# EAGLE schematic 1.4Fv3 (EAGLE 9.2.2)
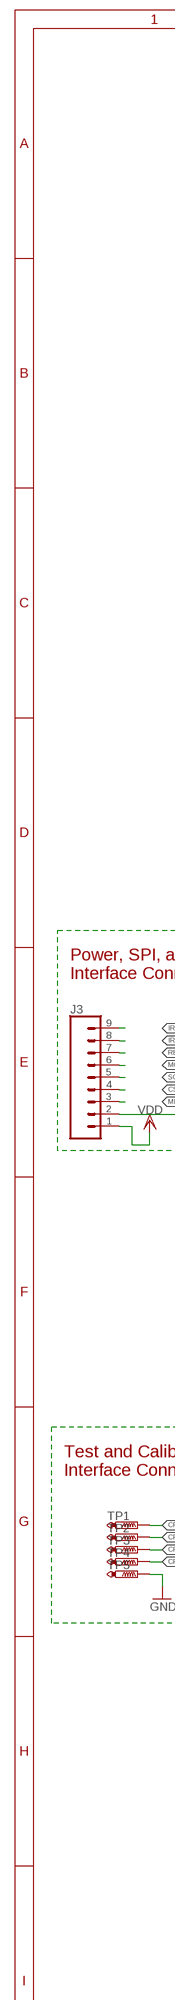
[diagram p0: schematic, sheet 1, part 1 of 3]
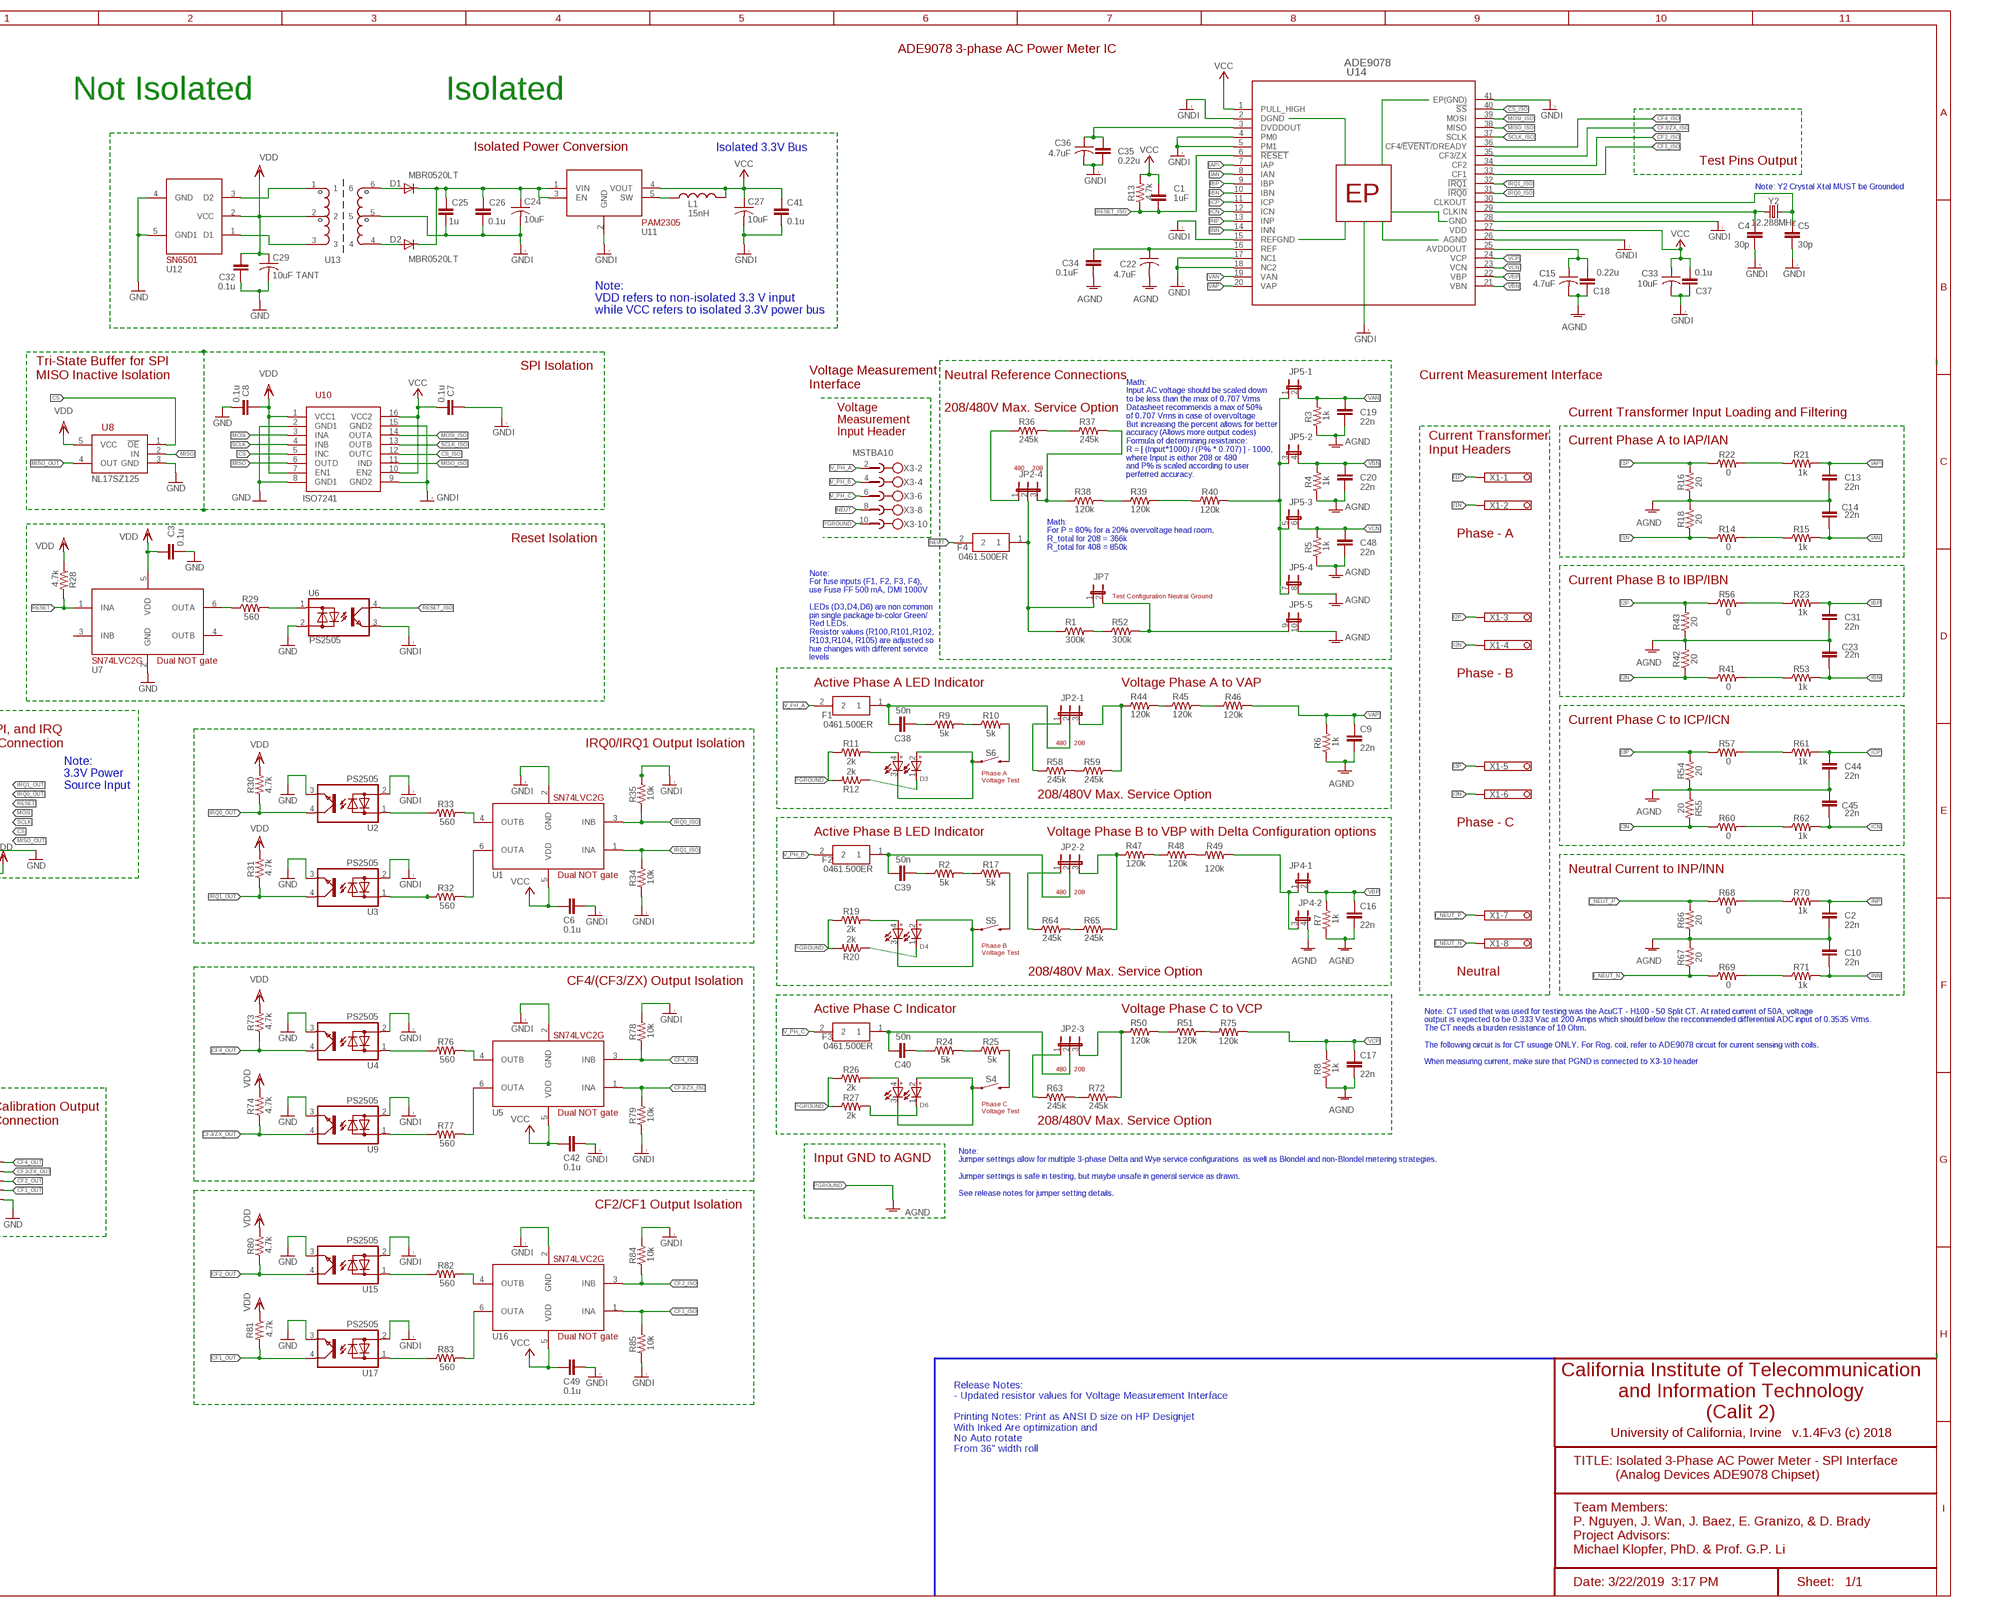
[diagram p1: schematic, sheet 1, part 2 of 3]
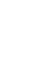
[diagram p2: schematic, sheet 1, part 3 of 3]

## Parts
C1  1uF  10NF-0603-50V-10%  [0603]
C2  22n  0402-CAP  [0402-CAP]
C3  0.1u  0402-CAP  [0402-CAP]
C4  30p  0402-CAP  [0402-CAP]
C5  30p  0402-CAP  [0402-CAP]
C6  0.1u  0402-CAP  [0402-CAP]
C7  0.1u  0402-CAP  [0402-CAP]
C8  0.1u  0402-CAP  [0402-CAP]
C9  22n  0402-CAP  [0402-CAP]
C10  22n  0402-CAP  [0402-CAP]
C13  22n  0402-CAP  [0402-CAP]
C14  22n  0402-CAP  [0402-CAP]
C15  4.7uF  C-USC0603  [C0603]
C16  22n  0402-CAP  [0402-CAP]
C17  22n  0402-CAP  [0402-CAP]
C18  0.22u  0402-CAP  [0402-CAP]
C19  22n  0402-CAP  [0402-CAP]
C20  22n  0402-CAP  [0402-CAP]
C22  4.7uF  C-USC0603  [C0603]
C23  22n  0402-CAP  [0402-CAP]
C24  10uF  C-USC0603  [C0603]
C25  1u  0402-CAP  [0402-CAP]
C26  0.1u  0402-CAP  [0402-CAP]
C27  10uF  C-USC0603  [C0603]
C29  10uF TANT  C-USC0603  [C0603]
C31  22n  0402-CAP  [0402-CAP]
C32  0.1u  0402-CAP  [0402-CAP]
C33  10uF  C-USC0603  [C0603]
C34  0.1uF  0402-CAP  [0402-CAP]
C35  0.22u  0402-CAP  [0402-CAP]
C36  4.7uF  C-USC0603  [C0603]
C37  0.1u  0402-CAP  [0402-CAP]
C38  50n  0402-CAP  [0402-CAP]
C39  50n  0402-CAP  [0402-CAP]
C40  50n  0402-CAP  [0402-CAP]
C41  0.1u  0402-CAP  [0402-CAP]
C42  0.1u  0402-CAP  [0402-CAP]
C44  22n  0402-CAP  [0402-CAP]
C45  22n  0402-CAP  [0402-CAP]
C48  22n  0402-CAP  [0402-CAP]
C49  0.1u  0402-CAP  [0402-CAP]
D1  MBR0520LT  [SOD123]
D2  MBR0520LT  [SOD123]
D3  WL-SBCW_0606_150066SV74000  [WL-SBCW_0606]
D4  WL-SBCW_0606_150066SV74000  [WL-SBCW_0606]
D6  WL-SBCW_0606_150066SV74000  [WL-SBCW_0606]
F1  0461.500ER  [FUSC10131X312N]
F2  0461.500ER  [FUSC10131X312N]
F3  0461.500ER  [FUSC10131X312N]
F4  0461.500ER  [FUSC10131X312N]
J3  CONN_09  [1X09]
JP2-1  JP2E  [JP2]
JP2-2  JP2E  [JP2]
JP2-3  JP2E  [JP2]
JP2-4  JP2E  [JP2]
JP4  JP2QE  [JP2Q]
JP5  JP5QE  [JP5Q]
JP7  JP1E  [JP1]
L1  15nH  IND0402  [0402-RES]
R1  300k  R_2010  [R2010]
R2  5k  RESISTOR0603  [0603]
R3  1k  RESISTOR0603  [0603]
R4  1k  RESISTOR0603  [0603]
R5  1k  RESISTOR0603  [0603]
R6  1k  RESISTOR0603  [0603]
R7  1k  RESISTOR0603  [0603]
R8  1k  RESISTOR0603  [0603]
R9  5k  RESISTOR0603  [0603]
R10  5k  RESISTOR0603  [0603]
R11  2k  RESISTOR0603  [0603]
R12  2k  RESISTOR0603  [0603]
R13  4.7k  RESISTOR0603  [0603]
R14  0  RESISTOR0603  [0603]
R15  1k  RESISTOR0603  [0603]
R16  20  RESISTOR0603  [0603]
R17  5k  RESISTOR0603  [0603]
R18  20  RESISTOR0603  [0603]
R19  2k  RESISTOR0603  [0603]
R20  2k  RESISTOR0603  [0603]
R21  1k  RESISTOR0603  [0603]
R22  0  RESISTOR0603  [0603]
R23  1k  RESISTOR0603  [0603]
R24  5k  RESISTOR0603  [0603]
R25  5k  RESISTOR0603  [0603]
R26  2k  RESISTOR0603  [0603]
R27  2k  RESISTOR0603  [0603]
R28  4.7k  RESISTOR0603  [0603]
R29  560  RESISTOR0603  [0603]
R30  4.7k  RESISTOR0603  [0603]
R31  4.7k  RESISTOR0603  [0603]
R32  560  RESISTOR0603  [0603]
R33  560  RESISTOR0603  [0603]
R34  10k  RESISTOR0603  [0603]
R35  10k  RESISTOR0603  [0603]
R36  245k  R_2010  [R2010]
R37  245k  R_2010  [R2010]
R38  120k  R_2010  [R2010]
R39  120k  R_2010  [R2010]
R40  120k  RESISTOR0603  [0603]
R41  0  RESISTOR0603  [0603]
R42  20  RESISTOR0603  [0603]
R43  20  RESISTOR0603  [0603]
R44  120k  R_2010  [R2010]
R45  120k  R_2010  [R2010]
R46  120k  RESISTOR0603  [0603]
R47  120k  R_2010  [R2010]
R48  120k  R_2010  [R2010]
R49  120k  RESISTOR0603  [0603]
R50  120k  R_2010  [R2010]
R51  120k  R_2010  [R2010]
R52  300k  R_2010  [R2010]
R53  1k  RESISTOR0603  [0603]
R54  20  RESISTOR0603  [0603]
R55  20  RESISTOR0603  [0603]
R56  0  RESISTOR0603  [0603]
R57  0  RESISTOR0603  [0603]
R58  245k  R_2010  [R2010]
R59  245k  R_2010  [R2010]
R60  0  RESISTOR0603  [0603]
R61  1k  RESISTOR0603  [0603]
R62  1k  RESISTOR0603  [0603]
R63  245k  R_2010  [R2010]
R64  245k  R_2010  [R2010]
R65  245k  R_2010  [R2010]
R66  20  RESISTOR0603  [0603]
R67  20  RESISTOR0603  [0603]
R68  0  RESISTOR0603  [0603]
R69  0  RESISTOR0603  [0603]
R70  1k  RESISTOR0603  [0603]
R71  1k  RESISTOR0603  [0603]
R72  245k  R_2010  [R2010]
R73  4.7k  RESISTOR0603  [0603]
R74  4.7k  RESISTOR0603  [0603]
R75  120k  RESISTOR0603  [0603]
R76  560  RESISTOR0603  [0603]
R77  560  RESISTOR0603  [0603]
R78  10k  RESISTOR0603  [0603]
R79  10k  RESISTOR0603  [0603]
R80  4.7k  RESISTOR0603  [0603]
R81  4.7k  RESISTOR0603  [0603]
R82  560  RESISTOR0603  [0603]
R83  560  RESISTOR0603  [0603]
R84  10k  RESISTOR0603  [0603]
R85  10k  RESISTOR0603  [0603]
S4  MOMENTARY-SWITCH-SPST-SMD-4.5MM  [TACTILE_SWITCH_SMD_4.5MM]
S5  MOMENTARY-SWITCH-SPST-SMD-4.5MM  [TACTILE_SWITCH_SMD_4.5MM]
S6  MOMENTARY-SWITCH-SPST-SMD-4.5MM  [TACTILE_SWITCH_SMD_4.5MM]
TP1  PTR1B1,27  [B1,27]
TP2  PTR1B1,27  [B1,27]
TP3  PTR1B1,27  [B1,27]
TP4  PTR1B1,27  [B1,27]
TP5  PTR1B1,27  [B1,27]
U1  SN74LVC  [DCKT]
U2  PS2505  [PS2505]
U3  PS2505  [PS2505]
U4  PS2505  [PS2505]
U5  SN74LVC  [DCKT]
U6  PS2505  [PS2505]
U7  SN74LVC  [DCKT]
U8  NL17SZ125  [NL17SZ125]
U9  PS2505  [PS2505]
U10  ISO7241  [16-SOIC]
U11  PAM2305  [TSOT25]
U12  SN6501  [SOT-23-5]
U13  TRANSFO_3.3  [TRANSFO_3.3]
U14  ADE9078  [CP_40_7]
U15  PS2505  [PS2505]
U16  SN74LVC  [DCKT]
U17  PS2505  [PS2505]
X1  1751303  [1751303]
X3  MSTBA10  [MSTBA10]
Y2  12.288MHz  CRYSTAL-12.288MHZ"  [CRYSTAL-SMD-5X3.2-4PAD]

## Nets
AGND: C2.1 C9.2 C10.2 C13.1 C14.2 C15.2 C16.2 C17.2 C18.1 C19.2 C20.2 C22.2 C23.2 C31.1 C34.1 C44.1 C45.2 C48.2 JP4.4 JP5.8 JP5.10 R3.1 R4.1 R5.1 R6.1 R7.1 R8.1 R16.1 R18.2 R42.2 R43.1 R54.1 R55.1 R66.1 R67.2
AVDDOUT: C15.1 C18.2 U14.25(AVDDOUT)
CF1_ISO: R85.2 U14.33(CF1) U16.1(INA)
CF1_OUT: R81.2 TP4.TP U17.4(COLLERTOR)
CF2_ISO: R84.1 U14.34(CF2) U16.3(INB)
CF2_OUT: R80.1 TP3.TP U15.4(COLLERTOR)
CF3/ZX_ISO: R79.2 U5.1(INA) U14.35(CF3/ZX)
CF3/ZX_OUT: R74.1 TP2.TP U9.4(COLLERTOR)
CF4_ISO: R78.1 U5.3(INB) U14.36(CF4/!EVENT!/DREADY)
CF4_OUT: R73.1 TP1.TP U4.4(COLLERTOR)
CS: J3.4 U8.1(!OE) U10.5(INC)
CS_ISO: U10.12(OUTC) U14.40(!SS)
DVDDOUT: C35.2 C36.1 U14.3(DVDDOUT)
GND: C3.2 C8.2 C29.2 C32.1 J3.2 TP5.TP U2.3(EMITTER) U3.3(EMITTER) U4.3(EMITTER) U6.2(CATHODE) U7.2(GND) U8.3(GND) U9.3(EMITTER) U10.2(GND1) U10.8(GND1) U12.4(GND) U12.5(GND1) U15.3(EMITTER) U17.3(EMITTER)
GNDI: C4.1 C5.2 C6.1 C7.1 C24.2 C25.1 C26.1 C27.2 C33.2 C35.1 C36.2 C37.1 C41.2 C42.1 C49.1 R34.1 R35.2 R78.2 R79.1 R84.2 R85.1 U1.2(GND) U2.2(CATHODE) U3.2(CATHODE) U4.2(CATHODE) U5.2(GND) U6.3(EMITTER) U9.2(CATHODE) U10.9(GND2) U10.15(GND2) U11.2(GND) U13.5 U14.2(DGND) U14.4(PM0) U14.5(PM1) U14.15(REFGND) U14.17(NC1) U14.18(NC2) U14.26(AGND) U14.28(GND) U14.41(EP(GND)) U15.2(CATHODE) U16.2(GND) U17.2(CATHODE)
I1N: R14.1 R18.1 X1.2
I1P: R16.2 R22.1 X1.1
I2N: R41.1 R42.1 X1.4
I2P: R43.2 R56.1 X1.3
I3N: R55.2 R60.1 X1.6
I3P: R54.2 R57.1 X1.5
I_NEUT_N: R67.1 R69.1 X1.8
I_NEUT_P: R66.2 R68.1 X1.7
IAN: C14.1 R15.2 U14.8(IAN)
IAP\: C13.2 R21.2 U14.7(IAP)
IBN: C23.1 R53.2 U14.10(IBN)
IBP: C31.2 R23.2 U14.9(IBP)
ICN: C45.1 R62.2 U14.12(ICN)
ICP: C44.2 R61.2 U14.11(ICP)
INN: C10.1 R71.2 U14.14(INN)
INP: C2.2 R70.2 U14.13(INP)
IRQ0_ISO: R35.1 U1.3(INB) U14.31(!IRQ0)
IRQ0_OUT: J3.8 R30.1 U2.4(COLLERTOR)
IRQ1_ISO: R34.2 U1.1(INA) U14.32(!IRQ1)
IRQ1_OUT: J3.9 R31.1 U3.4(COLLERTOR)
MISO: U8.2(IN) U10.6(OUTD)
MISO_ISO: U10.11(IND) U14.38(MISO)
MISO_OUT: J3.3 U8.4(OUT)
MOSI: J3.6 U10.3(INA)
MOSI_ISO: U10.14(OUTA) U14.39(MOSI)
N$1: C5.1 U14.30(CLKOUT) Y2.3
N$2: R21.1 R22.2
N$3: R14.2 R15.1
N$4: L1.1 U11.5(SW)
N$7: R57.2 R61.1
N$8: R60.2 R62.1
N$10: C38.2 R9.1
N$11: R32.2 U1.6(OUTA)
N$12: R32.1 U3.1(ANODE)
N$13: C4.2 U14.29(CLKIN) Y2.1
N$16: R25.2 S4.1 S4.4
N$18: D1.A U13.6
N$19: C24.1 C25.2 C26.2 D1.C D2.C U11.1(VIN) U11.3(EN)
N$20: D2.A U13.4
N$21: U12.3(D2) U13.1
N$23: U12.1(D1) U13.3
N$24: R23.1 R56.2
N$25: R29.2 U6.1(ANODE)
N$26: R29.1 U7.6(OUTA)
N$27: R41.2 R53.1
N$28: R9.2 R10.1
N$30: R33.2 U1.4(OUTB)
N$31: R76.2 U5.4(OUTB)
N$33: R1.2 R52.1
N$34: R64.2 R65.1
N$39: R33.1 U2.1(ANODE)
N$40: JP2-1.1 R58.1
N$41: R58.2 R59.1
N$42: R10.2 S6.1 S6.4
N$43: JP2-1.3 R44.1 R59.2
N$44: JP2-2.1 R64.1
N$46: JP2-2.3 R47.1 R65.2
N$47: R63.2 R72.1
N$48: R68.2 R70.1
N$50: JP2-4.3 R37.2 R38.1
N$52: JP2-4.1 R36.1
N$53: R36.2 R37.1
N$54: JP5.9 JP7.2 R52.2
N$56: R69.2 R71.1
N$58: C39.2 R2.1
N$59: R2.2 R17.1
N$60: R17.2 S5.1 S5.4
N$61: D3.1(C2) R12.1
N$62: D6.2(A2) D6.3(C1) S4.2 S4.3
N$63: C40.2 R24.1
N$64: R24.2 R25.1
N$65: D3.4(A1) R11.2
N$66: D4.2(A2) D4.3(C1) S5.2 S5.3
N$67: R76.1 U4.1(ANODE)
N$68: R77.1 U9.1(ANODE)
N$69: R77.2 U5.6(OUTA)
N$71: JP5.1 JP5.3 JP5.5 JP5.7 R40.2
N$72: R82.1 U15.1(ANODE)
N$73: R83.1 U17.1(ANODE)
N$74: R83.2 U16.6(OUTA)
N$76: D3.2(A2) D3.3(C1) S6.2 S6.3
N$78: D4.4(A1) R19.2
N$79: R45.2 R46.1
N$81: C40.1 F3.1 JP2-3.2
N$82: F4.1 JP2-4.2 JP7.1 R1.1
N$83: C38.1 F1.1 JP2-1.2
N$84: R48.2 R49.1
N$85: JP2-3.3 R50.1 R72.2
N$86: JP4.1 JP4.3 R49.2
N$87: C39.1 F2.1 JP2-2.2
N$90: JP2-3.1 R63.1
N$96: R50.2 R51.1
N$97: R51.2 R75.1
N$99: R82.2 U16.4(OUTB)
N$102: R44.2 R45.1
N$107: R47.2 R48.1
N$112: R38.2 R39.1
N$113: R39.2 R40.1
N$118: D4.1(C2) R20.1
N$121: D6.1(C2) R27.2
N$122: D6.4(A1) R26.2
NEUT: F4.2 X3.8
PGROUND: R11.1 R12.2 R19.1 R20.2 R26.1 R27.1 X3.10 ; supply symbol labelled AGND
REF: C22.1 C34.2 U14.16(REF)
RESET: J3.7 R28.2 U7.1(INA)
RESET_ISO: C1.2 R13.1 U6.4(COLLERTOR) U14.6(!RESET)
SCLK: J3.5 U10.4(INB)
SCLK_ISO: U10.13(OUTB) U14.37(SCLK)
V_PH_A: F1.2 X3.2
V_PH_B: F2.2 X3.4
V_PH_C: F3.2 X3.6
VAN: C19.1 JP5.2 R3.2 U14.19(VAN)
VAP: C9.1 R6.2 R46.2 U14.20(VAP)
VBN: C20.1 JP5.4 R4.2 U14.21(VBN)
VBP: C16.1 JP4.2 R7.2 U14.22(VBP)
VCC: C1.1 C6.2 C7.2 C27.1 C33.1 C37.2 C41.1 C42.2 C49.2 L1.2 R13.2 U1.5(VDD) U5.5(VDD) U10.10(EN2) U10.16(VCC2) U11.4(VOUT) U14.1(PULL_HIGH) U14.27(VDD) U16.5(VDD)
VCN: C48.1 JP5.6 R5.2 U14.23(VCN)
VCP: C17.1 R8.2 R75.2 U14.24(VCP)
VDD: C3.1 C8.1 C29.1 C32.2 J3.1 R28.1 R30.2 R31.2 R73.2 R74.2 R80.2 R81.1 U7.5(VDD) U8.5(VCC) U10.1(VCC1) U10.7(EN1) U12.2(VCC) U13.2
Unconnected: U7.3(INB) U7.4(OUTB) X3.1 X3.3 X3.5 X3.7 X3.9

## Notes on the sheet
- ADE9078 3-phase AC Power Meter IC
- Not Isolated | Isolated
- Isolated Power Conversion | Isolated 3.3V Bus
- Test Pins Output
- Note: Y2 Crystal Xtal MUST be Grounded
- EP
- Note: 
  VDD refers to non-isolated 3.3 V input
  while VCC refers to isolated 3.3V power bus
- SPI Isolation
- Tri-State Buffer for SPI
  MISO Inactive Isolation
- Neutral Reference Connections
- Math: 
  Input AC voltage should be scaled down 
  to be less than the max of 0.707 Vrms
  Datasheet recommends a max of 50%
  of 0.707 Vrms in case of overvoltage
  But increasing the percent allows for better
  accuracy (Allows more output codes)
  Formula of determining resistance:
  R = [ (Input*1000) / (P% * 0.707) ] - 1000,  
  where Input is either 208 or 480 
  and P% is scaled according to user
  perferred accuracy.
- Current Measurement Interface
- Voltage Measurement 
  Interface
- 208/480V Max. Service Option
- Current Transformer Input Loading and Filtering
- Voltage 
  Measurement 
  Input Header
- Current Phase A to IAP/IAN
- Current Transformer 
  Input Headers
- 480 | 208
- ISO7241
- Math: 
  For P = 80% for a 20% overvoltage head room,
  R_total for 208 = 366k
  R_total for 408 = 850k
- Phase - A
- Reset Isolation
- Note: 
  For fuse inputs (F1, F2, F3, F4),
  use Fuse FF 500 mA, DMI 1000V
  
  LEDs (D3,D4,D6) are non common
  pin single package bi-color Green/
  Red LEDs.
  Resistor values (R100,R101,R102,
  R103,R104, R105) are adjusted so 
  hue changes with different service 
  levels
- Current Phase B to IBP/IBN
- Test Configuration Neutral Ground
- Dual NOT gate
- Phase - B
- Active Phase A LED Indicator | Voltage Phase A to VAP
- Current Phase C to ICP/ICN
- 480 | 208
- Power, SPI, and IRQ
  Interface Connection
- IRQ0/IRQ1 Output Isolation
- Note: 
  3.3V Power 
  Source Input
- Phase A
  Voltage Test
- 208/480V Max. Service Option
- Phase - C
- Active Phase B LED Indicator | Voltage Phase B to VBP with Delta Configuration options
- Neutral Current to INP/INN
- Dual NOT gate
- 480 | 208
- Phase B
  Voltage Test
- 208/480V Max. Service Option | Neutral
- CF4/(CF3/ZX) Output Isolation
- Note: CT used that was used for testing was the AcuCT - H100 - 50 Split CT. At rated current of 50A, voltage 
  output is expected to be 0.333 Vac at 200 Amps which should below the reccommended differential ADC input of 0.3535 Vrms. 
  The CT needs a burden resistance of 10 Ohm. 
  
  The following circuit is for CT usuage ONLY. For Rog. coil, refer to ADE9078 circuit for current sensing with coils.
  
  When measuring current, make sure that PGND is connected to X3-10 header
- Active Phase C Indicator | Voltage Phase C to VCP
- 480 | 208
- Phase C
  Voltage Test
- Dual NOT gate
- Test and Calibration Output
  Interface Connection
- 208/480V Max. Service Option
- Note: 
  Jumper settings allow for multiple 3-phase Delta and Wye service configurations  as well as Blondel and non-Blondel metering strategies. 
  
  Jumper settings is safe in testing, but maybe unsafe in general service as drawn. 
  
  See release notes for jumper setting details.
- Input GND to AGND
- CF2/CF1 Output Isolation
- Dual NOT gate
- Release Notes: 
  - Updated resistor values for Voltage Measurement Interface
  
  Printing Notes: Print as ANSI D size on HP Designjet 
  With Inked Are optimization and 
  No Auto rotate 
  From 36" width roll
- California Institute of Telecommunication
  and Information Technology
  (Calit 2)
- University of California, Irvine   v.1.4Fv3 (c) 2018
- TITLE: Isolated 3-Phase AC Power Meter - SPI Interface
              (Analog Devices ADE9078 Chipset)
- Team Members:
  P. Nguyen, J. Wan, J. Baez, E. Granizo, & D. Brady 
  Project Advisors:
  Michael Klopfer, PhD. & Prof. G.P. Li
- Date: 3/22/2019  3:17 PM | Sheet:   1/1

## Library data of the parts
C1 = SparkFun-Capacitors:10NF: 0.01uF/10nF/10,000pF ceramic capacitors A capacitor is a passive two-terminal electrical component used to store electrical energy temporarily in an electric field. CAP-09321; MPN: MC0805B104K500A5.08MM; OC_NEWARK: 46P6240; PROD_ID: CAP-00867; VALUE: 10nF
C2 C9 C10 C13 C14 C16 C17 C19 C20 C23 C31 C38-C40 C44 C45 C48 = Nizanlib:0402-CAP; MF: KEMET; MPN: C0603C223K5RACTU; OC_NEWARK: 03C3260
C3 C6-C8 C25 C26 C32 C34 C37 C41 C42 C49 = Nizanlib:0402-CAP; MPN: C0603X5R1A104K030BC; OC_NEWARK: 04X3188
C4 C5 = Nizanlib:0402-CAP; MPN: MC0402N180J500CT; OC_NEWARK: 06R4796
C15 C22 C24 C27 C33 C36 = resistor:C-US: CAPACITOR, American symbol; MPN: C1608X5R1A106K080AC; OC_NEWARK: 04X3243
C18 C35 = Nizanlib:0402-CAP; MPN: MC0805F224Z500CT; OC_NEWARK: 06R3958
C29 = resistor:C-US: CAPACITOR, American symbol; MF: VISHAY/SPRAGUE; MPN: 195D106X96R3V2T; OC_NEWARK: 08J0446
D1 D2 = diode:MBR0520LT: SCHOTTKY BARRIER RECTIFIER Source: http://onsemi.com .. MBR0520LT1-D.pdf; MPN: MBR0520LT1G.; OC_NEWARK: 26AC1776
D3 D4 D6 = Wurth_Elektronik_Optoelectronics_rev18a:WL-SBCW_0606: SMD bi-color Chip LED Characteristics Two chips in one package Small size Industry standard footprint High efficiency Low power consumption Wide viewing angle Small package for exceptional brightness Packaged in standard tape and reel 7" Compatible with automatic placement machine Applications Backlighting applications Status indicator Front panel indicators Push button backlighting Symbol and switch backlighting <http://katalog.we-online.de/media/images/v2/Family_WL_SBCW.jpg> Details see: http://katalog.we-online.de/en/led/WL-SBCW?m Updated 2015-04-10 2015 (C) Wurth Elektronik
F1-F4 = SamacSys_Parts:0461.500ER: Littelfuse 0.5A Non-Resettable Surface Mount Fuse, 600 V Source: Datasheet <http://www.mouser.com/datasheet/2/240/Littelfuse_Fuse_461_Datasheet.pdf-968630.pdf>; DESCRIPTION: Littelfuse 0.5A Non-Resettable Surface Mount Fuse, 600 V; HEIGHT: 3.12mm; MANUFACTURER_NAME: LITTELFUSE; MANUFACTURER_PART_NUMBER: 0461.500ER; MOUSER_PART_NUMBER: 576-0461.500ER
J3 = SparkFun-Connectors:CONN_09: Multi connection point. Often used as Generic Header-pin footprint for 0.1 inch spaced/style header connections On any of the 0.1 inch spaced packages, you can populate with these: Break Away Headers - Straight <https://www.sparkfun.com/products/116> (PRT-00116) Break Away Male Headers - Right Angle <https://www.sparkfun.com/products/553> (PRT-00553) Female Headers <https://www.sparkfun.com/products/115> (PRT-00115) Break Away Headers - Machine Pin <https://www.sparkfun.com/products/117> (PRT-00117) Break Away Female Headers - Swiss Machine Pin <https://www.sparkfun.com/products/743> (PRT-00743) For SCREWTERMINALS and SPRING TERMINALS visit here: Screw Terimnals on SparkFun.com <https://www.sparkfun.com/search/results?term=Screw+Terminals> (5mm/3.5mm/2.54mm spacing) This device is also useful as a general connection point to wire up your design to another part of your project. Our various solder wires solder well into these plated through hole pads. Hook-Up Wire - Assortment (Stranded, 22 AWG) <https://www.sparkfun.com/products/11375> (PRT-11375) Hook-Up Wire - Assortment (Solid Core, 22 AWG) <https://www.sparkfun.com/products/11367> (PRT-11367) View the entire wire category on our website here <https://www.sparkfun.com/categories/141> Special notes: Molex polarized connector foot print use with SKU : PRT-08231 with associated crimp pins and housings. 1MM SMD Version SKU: PRT-10208 NOTES ON THE VARIANTS LOCK and LOCK_LONGPADS... This footprint was designed to help hold the alignment of a through-hole component (i.e. 6-pin header) while soldering it into place. You may notice that each hole has been shifted either up or down by 0.005 of an inch from it's more standard position (which is a perfectly straight line). This slight alteration caused the pins (the squares in the middle) to touch the edges of the holes. Because they are alternating, it causes a "brace" to hold the component in place. 0.005 has proven to be the perfect amount of "off-center" position when using our standard breakaway headers. Although looks a little odd when you look at the bare footprint, once you have a header in there, the alteration is very hard to notice. Also,if you push a header all the way into place, it is covered up entirely on the bottom side.; MF: TYCO ELECTRONICS; MPN: 350547-1; OC_NEWARK: 01C1197
JP2-1-JP2-4 = jumper:JP2E: JUMPER
JP4 = jumper:JP2QE: JUMPER; MF: TYCO ELECTRONICS; MPN: 350547-1; OC_NEWARK: 01C1197
JP5 = jumper:JP5QE: JUMPER; MF: TYCO ELECTRONICS; MPN: 350547-1; OC_NEWARK: 01C1197
JP7 = jumper:JP1E: JUMPER
L1 = Nizanlib:IND0402; OC_NEWARK: unknown
R1 R36-R39 R44 R45 R47 R48 R50-R52 R58 R59 R63-R65 R72 = rc-master-smd:R_: RESISTOR
R2-R35 R40-R43 R46 R49 R53-R57 R60-R62 R66-R71 R73-R85 = SparkFun-Resistors:RESISTOR: Generic Resistor Package
S4-S6 = SparkFun-Switches:MOMENTARY-SWITCH-SPST: Momentary Switch (Pushbutton) - SPST Normally-open (NO) SPST momentary switches (buttons, pushbuttons). Variants PTH-12MM - 12mm square, through-hole Momentary Pushbutton Switch - 12mm Square <https://www.sparkfun.com/products/9190> (COM-09190) PTH-6.0MM, PTH-6.0MM-KIT - 6.0mm square, through-hole Mini Pushbutton Switch <https://www.sparkfun.com/products/97> (COM-00097) KIT package intended for soldering kit's - only one side of pads' copper is exposed. PTH-RIGHT-ANGLE-KIT - Right-angle, through-hole Right Angle Tactile Button <https://www.sparkfun.com/products/10791> - Used on SparkFun BigTime Watch Kit <https://www.sparkfun.com/products/11734> SMD-12MM - 12mm square, surface-mount Tactile Button - SMD (12mm) <https://www.sparkfun.com/products/12993> (COM-12993) Used on SparkFun PicoBoard <https://www.sparkfun.com/products/11888> SMD-4.5MM - 4.5mm Square Trackball Switch Used on SparkFun Blackberry Trackballer Breakout <https://www.sparkfun.com/products/13169> SMD-4.6MMX2.8MM - 4.60mm x 2.80mm, surface mount Used on SparkFun SAMD21 Mini Breakout <https://www.sparkfun.com/products/13664> SMD-5.2MM, SMD-5.2-REDUNDANT - 5.2mm square, surface-mount Mini Pushbutton Switch - SMD <https://www.sparkfun.com/products/8720> (COM-08720) Used on Arduino Pro Mini <https://www.sparkfun.com/products/11114> REDUNDANT package connects both switch circuits together SMD-6.0X3.5MM - 6.0 x 3.5mm, surface mount Momentary Reset Switch SMD <https://www.sparkfun.com/products/8229> (COM-08229) SMD-6.2MM-TALL - 6.2mm square, surface mount Tactile Button - SMD (6mm) <https://www.sparkfun.com/products/12992> Used on SparkFun Digital Sandbox <https://www.sparkfun.com/products/12651> SMD-RIGHT-ANGLE - Right-angle, surface mount Used on SparkFun Block for Intel® Edison - Arduino <https://www.sparkfun.com/products/13036>; PROD_ID: SWCH-09213
TP1-TP5 = testpad:PTR1: TEST PIN
U1 U5 U16 = Damien_divers:SN74LVC; MF: TEXAS INSTRUMENTS; MPN: SN74LVC1G34DBVR; OC_NEWARK: 01J0787
U2-U4 U6 U9 U15 U17 = wattmeter:PS2505; MPN: PS2505-4-A; OC_NEWARK: 09X6256
U7 = Damien_divers:SN74LVC; MF: TEXAS INSTRUMENTS; MPN: SN74LVC1G34DBVR; OC_NEWARK: 01J0787; SPICEPREFIX: X
U8 = wattmeter:NL17SZ125; MPN: SN74LVC1G125DRLR; OC_NEWARK: 01X3093
U10 = wattmeter:ISO7241; MPN: ISO7241CQDWRQ1; OC_NEWARK: 58Y3495
U11 = Damien_regulator:PAM2305; OC_NEWARK: unknown
U12 = CalPlug:SN6501; MPN: SN6501DBVT; OC_NEWARK: 05W5796
U13 = Damien_power:TRANSFO_3.3; OC_NEWARK: unknown
U14 = 9078v1:ADE9078; MPN: ADE9078ACPZ; OC_NEWARK: 15AC8059
X1 = con-phoenix-350:1751303: MKDS 1/ 8-3,5 Printklemme Nennstrom: 10 A Bemessungsspannung: 160 V Raster: 3,5 mm Polzahl: 8 Montageart: Löten Anschlussart: Schraubanschluss Anschlussrichtung vom Leiter zur Platine: 0° Source: http://eshop.phoenixcontact.com .. .pdf; OC_FARNELL: unknown; OC_NEWARK: unknown
X3 = con-phoenix-508:MSTBA10: PHOENIX; MF: FARNELL; MPN: 1757323; OC_FARNELL: 3705249; OC_NEWARK: 71C4168
Y2 = SparkFun-Clocks:CRYSTAL-12.288MHZ: 12.288MHz Crystal Digikey Example <http://www.digikey.com/product-detail/en/abracon-llc/ABM3B-12.288MHZ-B2-T/535-9117-1-ND/675634> Frequency: 12.288MHz Frequency Stability: ±50ppm Frequency Tolerance: ±20ppm Load Capacitance: 18pF SparkFun Products: MP3 Trigger <https://www.sparkfun.com/products/13720> SparkFun MP3 Player Shield <https://www.sparkfun.com/products/12660>; PROD_ID: XTAL-09653; SPICEPREFIX: B

## Net classes
0 default: clearance 0.205 mm